# EAGLE design pinchy (EAGLE 7.7.0)

## Sheet 1 of 2
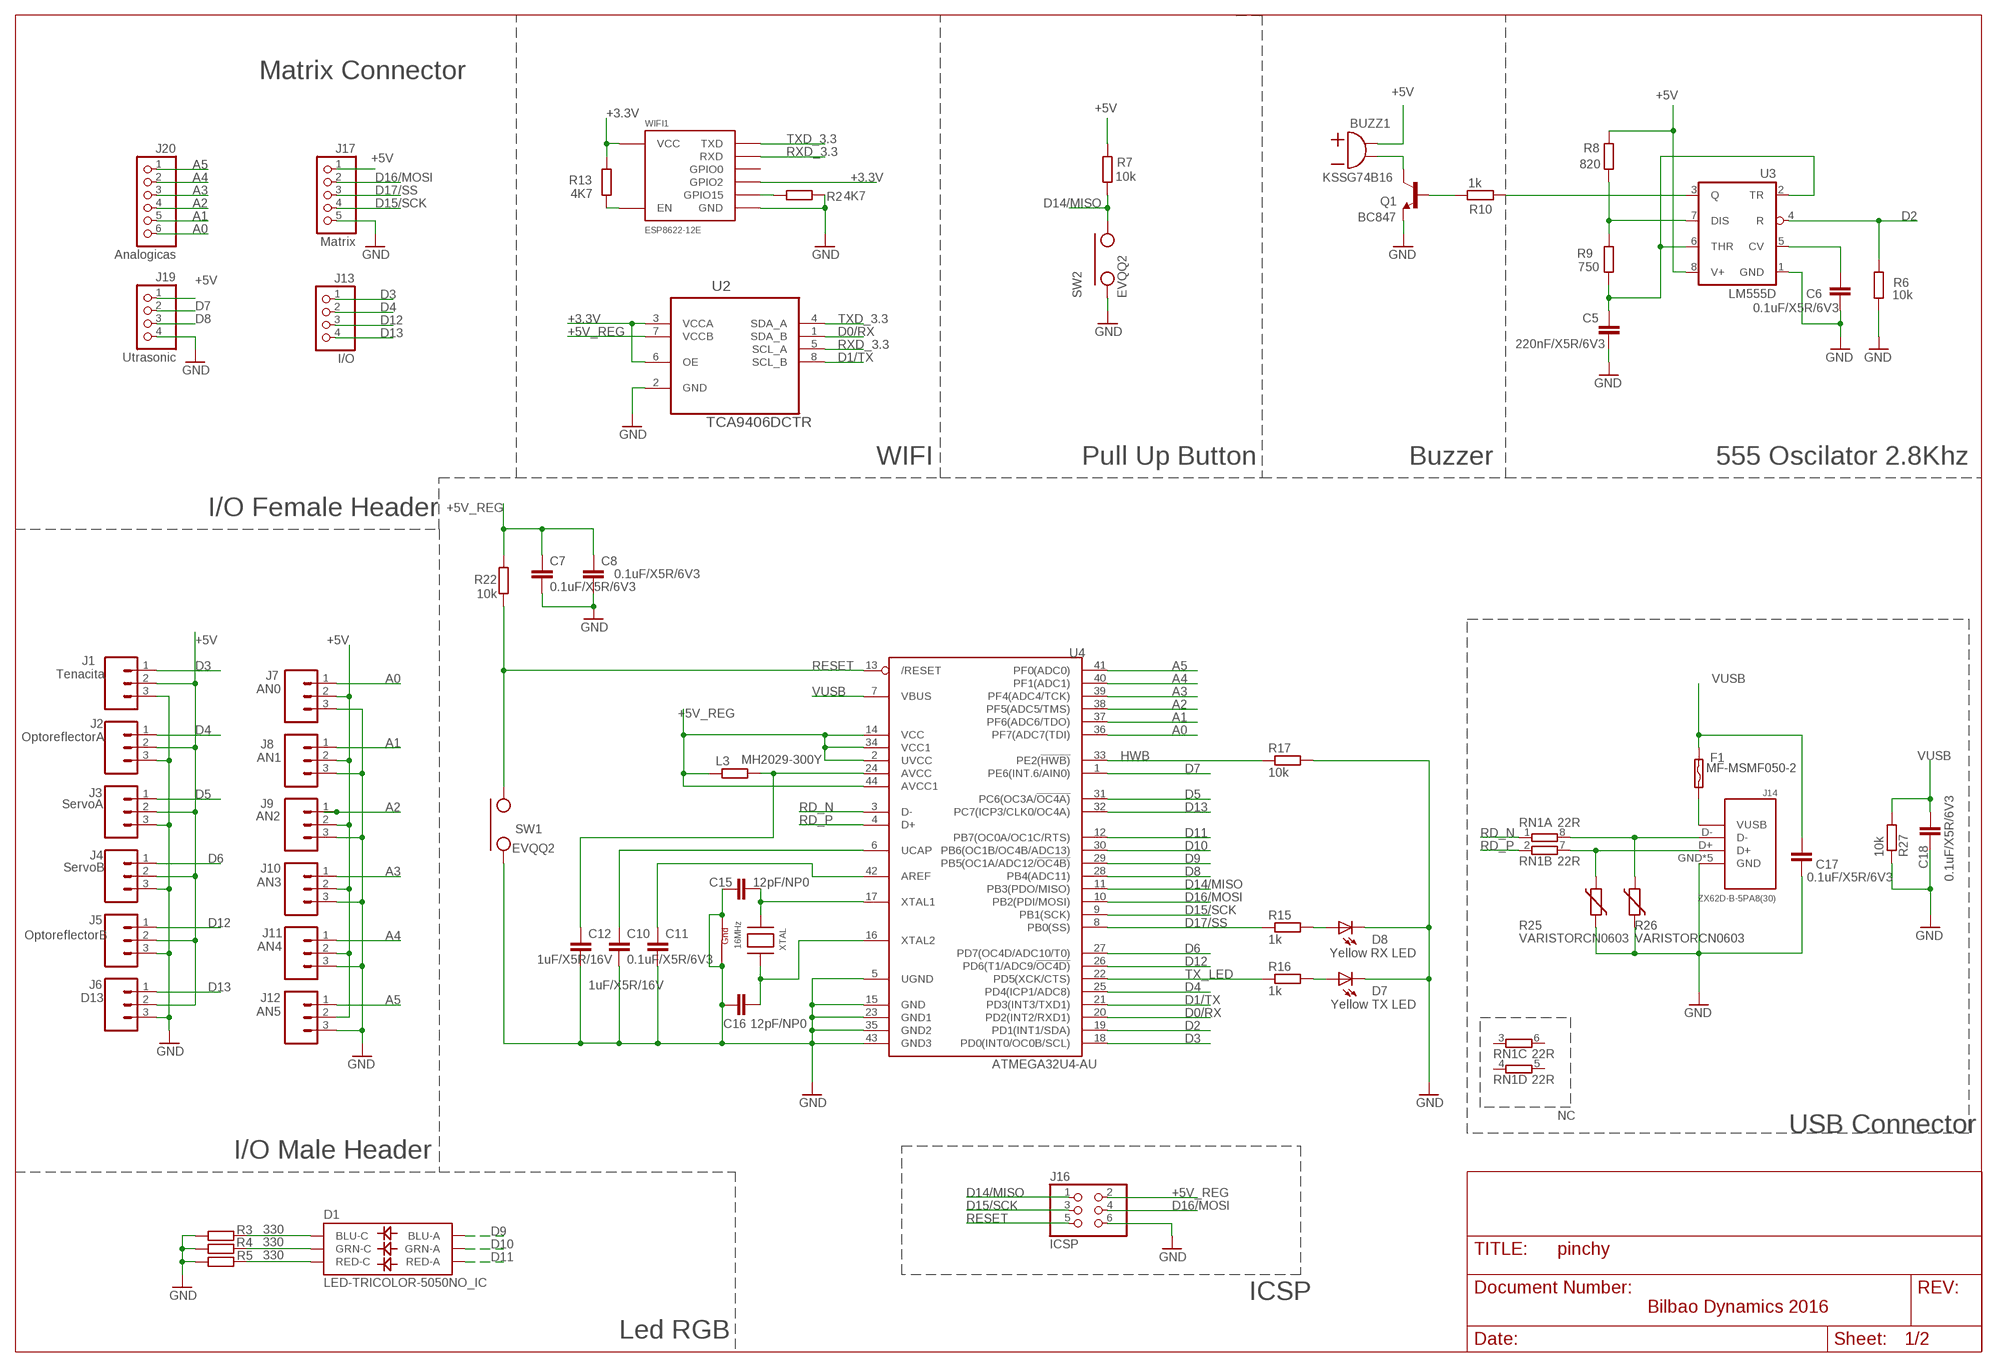
[diagram p0: schematic, sheet 1]

### Parts
BUZZ1  KSSG74B16  [KSSG74B16]
C5  220nF/X5R/6V3  C-EUC0805  [C0805]
C6  0.1uF/X5R/6V3  C-EUC0805  [C0805]
C7  0.1uF/X5R/6V3  C-EUC0805  [C0805]
C8  0.1uF/X5R/6V3  C-EUC0805  [C0805]
C10  1uF/X5R/16V  C-EUC1206  [C1206]
C11  0.1uF/X5R/6V3  C-EUC0805  [C0805]
C12  1uF/X5R/16V  C-EUC1206  [C1206]
C15  12pF/NP0  C-EUC0805  [C0805]
C16  12pF/NP0  C-EUC0805  [C0805]
C17  0.1uF/X5R/6V3  C-EUC1206  [C1206]
C18  0.1uF/X5R/6V3  C-EUC0805  [C0805]
D1  LED-TRICOLOR-5050NO_IC  [LED-TRICOLOR-5050]
D7  Yellow TX LED  LEDCHIPLED_0805  [CHIPLED_0805]
D8  Yellow RX LED  LEDCHIPLED_0805  [CHIPLED_0805]
F1  MF-MSMF050-2  SMD260F  [SMD050F]
J1  Tenacita  M03PTH  [1X03]
J2  OptoreflectorA  M03PTH  [1X03]
J3  ServoA  M03PTH  [1X03]
J4  ServoB  M03PTH  [1X03]
J5  OptoreflectorB  M03PTH  [1X03]
J6  D13  M03PTH  [1X03]
J7  AN0  M03PTH  [1X03]
J8  AN1  M03PTH  [1X03]
J9  AN2  M03PTH  [1X03]
J10  AN3  M03PTH  [1X03]
J11  AN4  M03PTH  [1X03]
J12  AN5  M03PTH  [1X03]
J13  I/O  PINHD-1X4  [1X04]
J14  ZX62D-B-5PA8(30)  [ZX62D-B-5PA8(30)]
J16  ICSP  PINHD-2X3  [2X03]
J17  Matrix  PINHD-1X5  [1X05]
J19  Utrasonic  PINHD-1X4  [1X04]
J20  Analogicas  PINHD-1X6  [1X06]
L3  MH2029-300Y  R-EU_R0805  [R0805]
Q1  BC847  [SOT23]
R2  4K7  R-EU_R0805  [R0805]
R3  330  R-EU_R0805  [R0805]
R4  330  R-EU_R0805  [R0805]
R5  330  R-EU_R0805  [R0805]
R6  10k  R-EU_R0805  [R0805]
R7  10k  R-EU_R0805  [R0805]
R8  820  R-EU_R0805  [R0805]
R9  750  R-EU_R0805  [R0805]
R10  1k  R-EU_R0805  [R0805]
R13  4K7  R-EU_R0805  [R0805]
R15  1k  R-EU_R0805  [R0805]
R16  1k  R-EU_R0805  [R0805]
R17  10k  R-EU_R0805  [R0805]
R22  10k  R-EU_R0805  [R0805]
R25  VARISTORCN0603  [CT/CN0603]
R26  VARISTORCN0603  [CT/CN0603]
R27  10k  R-EU_R0805  [R0805]
RN1  22R  4R-NCAY16  [CAY16]
SW1  EVQQ2  JAEGGER_MKII_EVQQ2  [JAEGGER_MKII_EVQQ2]
SW2  EVQQ2  JAEGGER_MKII_EVQQ2  [JAEGGER_MKII_EVQQ2]
U2  TCA9406DCTR  [SOP65P400X130-8N]
U3  LM555D  [SO08]
U4  ATMEGA32U4-AU  [TQFP44]
WIFI1  ESP8622-12E  [ESP8622-12E]
XTAL  16MHz  XTAL-4-3225  [NX3225]

### Nets
+3.3V: R13.2 U2.3(VCCA) U2.6(OE) WIFI1.GPIO2 WIFI1.VCC ; also sheet 2
+5V: BUZZ1.P$2 BUZZ1.P$3 J1.2 J2.2 J3.2 J4.2 J5.2 J6.2 J7.2 J8.2 J9.2 J10.2 J11.2 J12.2 J17.1 J19.1 R7.2 R8.2 U3.8(V+) ; also sheet 2
+5V_REG: C7.1 C8.1 J16.2 L3.1 R22.2 U2.7(VCCB) U4.2(UVCC) U4.14(VCC) U4.34(VCC1) U4.44(AVCC1) ; also sheet 2
A0: J7.1 J20.6 U4.36(PF7(ADC7(TDI))
A1: J8.1 J20.5 U4.37(PF6(ADC6/TDO))
A2: J9.1 J20.4 U4.38(PF5(ADC5/TMS))
A3: J10.1 J20.3 U4.39(PF4(ADC4/TCK))
A4: J11.1 J20.2 U4.40(PF1(ADC1))
A5: J12.1 J20.1 U4.41(PF0(ADC0))
D0/RX: U2.1(SDA_B) U4.20(PD2(INT2/RXD1))
D1/TX: U2.8(SCL_B) U4.21(PD3(INT3/TXD1))
D2: R6.1 U3.4(R) U4.19(PD1(INT1/SDA))
D3: J1.1 J13.1 U4.18(PD0(INT0/OC0B/SCL))
D4: J2.1 J13.2 U4.25(PD4(ICP1/ADC8))
D5: J3.1 U4.31(PC6(OC3A/!OC4A))
D6: J4.1 U4.27(PD7(OC4D/ADC10/T0))
D7: J19.2 U4.1(PE6(INT.6/AIN0))
D8: J19.3 U4.28(PB4(ADC11))
D9: D1.3(BLU-A) U4.29(PB5(OC1A/ADC12/!OC4B))
D10: D1.1(GRN-A) U4.30(PB6(OC1B/OC4B/ADC13))
D11: D1.2(RED-A) U4.12(PB7(OC0A/OC1C/RTS))
D12: J5.1 J13.3 U4.26(PD6(T1/ADC9/!OC4D))
D13: J6.1 J13.4 U4.32(PC7(ICP3/CLK0/OC4A))
D14/MISO: J16.1 R7.1 SW2.P$1 SW2.P$4 U4.11(PB3(PDO/MISO))
D15/SCK: J16.3 J17.4 U4.9(PB1(SCK))
D16/MOSI: J16.4 J17.2 U4.10(PB2(PDI/MOSI))
D17/SS: J17.3 R15.1 U4.8(PB0(SS))
GND: C5.2 C6.2 C7.2 C8.2 C10.2 C11.2 C12.2 C15.2 C16.2 C17.2 C18.2 D7.C D8.C J1.3 J2.3 J3.3 J4.3 J5.3 J6.3 J7.3 J8.3 J9.3 J10.3 J11.3 J12.3 J14.GND J14.P$1(GND) J14.P$2(GND) J14.P$6(GND) J14.P$7(GND) J16.6 J17.5 J19.4 Q1.2(E) R2.2 R3.1 R4.1 R5.1 R6.2 R17.2 R25.1 R26.1 R27.1 SW1.P$2 SW1.P$3 SW2.P$2 SW2.P$3 U2.2(GND) U3.1(GND) U4.5(UGND) U4.15(GND) U4.23(GND1) U4.35(GND2) U4.43(GND3) WIFI1.GND XTAL.2(G2) XTAL.4(G1) ; also sheet 2
HWB: R17.1 U4.33(PE2(!HWB))
N$1: R8.1 R9.2 U3.7(DIS)
N$2: R10.2 U3.3(Q)
N$3: D1.4(BLU-C) R3.2
N$4: D1.6(GRN-C) R4.2
N$6: D1.5(RED-C) R5.2
N$8: R13.1 WIFI1.EN
N$10: BUZZ1.P$1 BUZZ1.P$4 Q1.3(C)
N$11: C5.1 R9.1 U3.2(TR) U3.6(THR)
N$13: C6.1 U3.5(CV)
N$15: Q1.1(B) R10.1
N$16: R2.1 WIFI1.GPIO15
N$18: J14.D+ R25.2 RN1.7
N$19: J14.D- R26.2 RN1.8
N$22: F1.1 J14.VUSB
N$30: C15.1 U4.17(XTAL1) XTAL.1(X1)
N$31: C16.1 U4.16(XTAL2) XTAL.3(X2)
N$34: C10.1 U4.6(UCAP)
N$35: C12.1 L3.2 U4.24(AVCC)
N$38: D8.A R15.2
N$47: D7.A R16.2
RD_N: RN1.1 U4.3(D-)
RD_P: RN1.2 U4.4(D+)
RESET: J16.5 R22.1 SW1.P$1 SW1.P$4 U4.13(/RESET)
RXD_3.3: U2.5(SCL_A) WIFI1.RXD
TX_LED: R16.1 U4.22(PD5(XCK/CTS))
TXD_3.3: U2.4(SDA_A) WIFI1.TXD
U4: C11.1 U4.42(AREF)
VUSB: C17.1 C18.1 F1.2 R27.2 U4.7(VBUS) ; also sheet 2
Unconnected: RN1.3 RN1.4 RN1.5 RN1.6 WIFI1.GPIO0

### Notes on the sheet
- Matrix Connector
- WIFI | Pull Up Button | Buzzer | 555 Oscilator 2.8Khz
- I/O Female Header
- NC
- USB Connector
- I/O Male Header
- ICSP
- Bilbao Dynamics 2016
- Led RGB

## Sheet 2 of 2
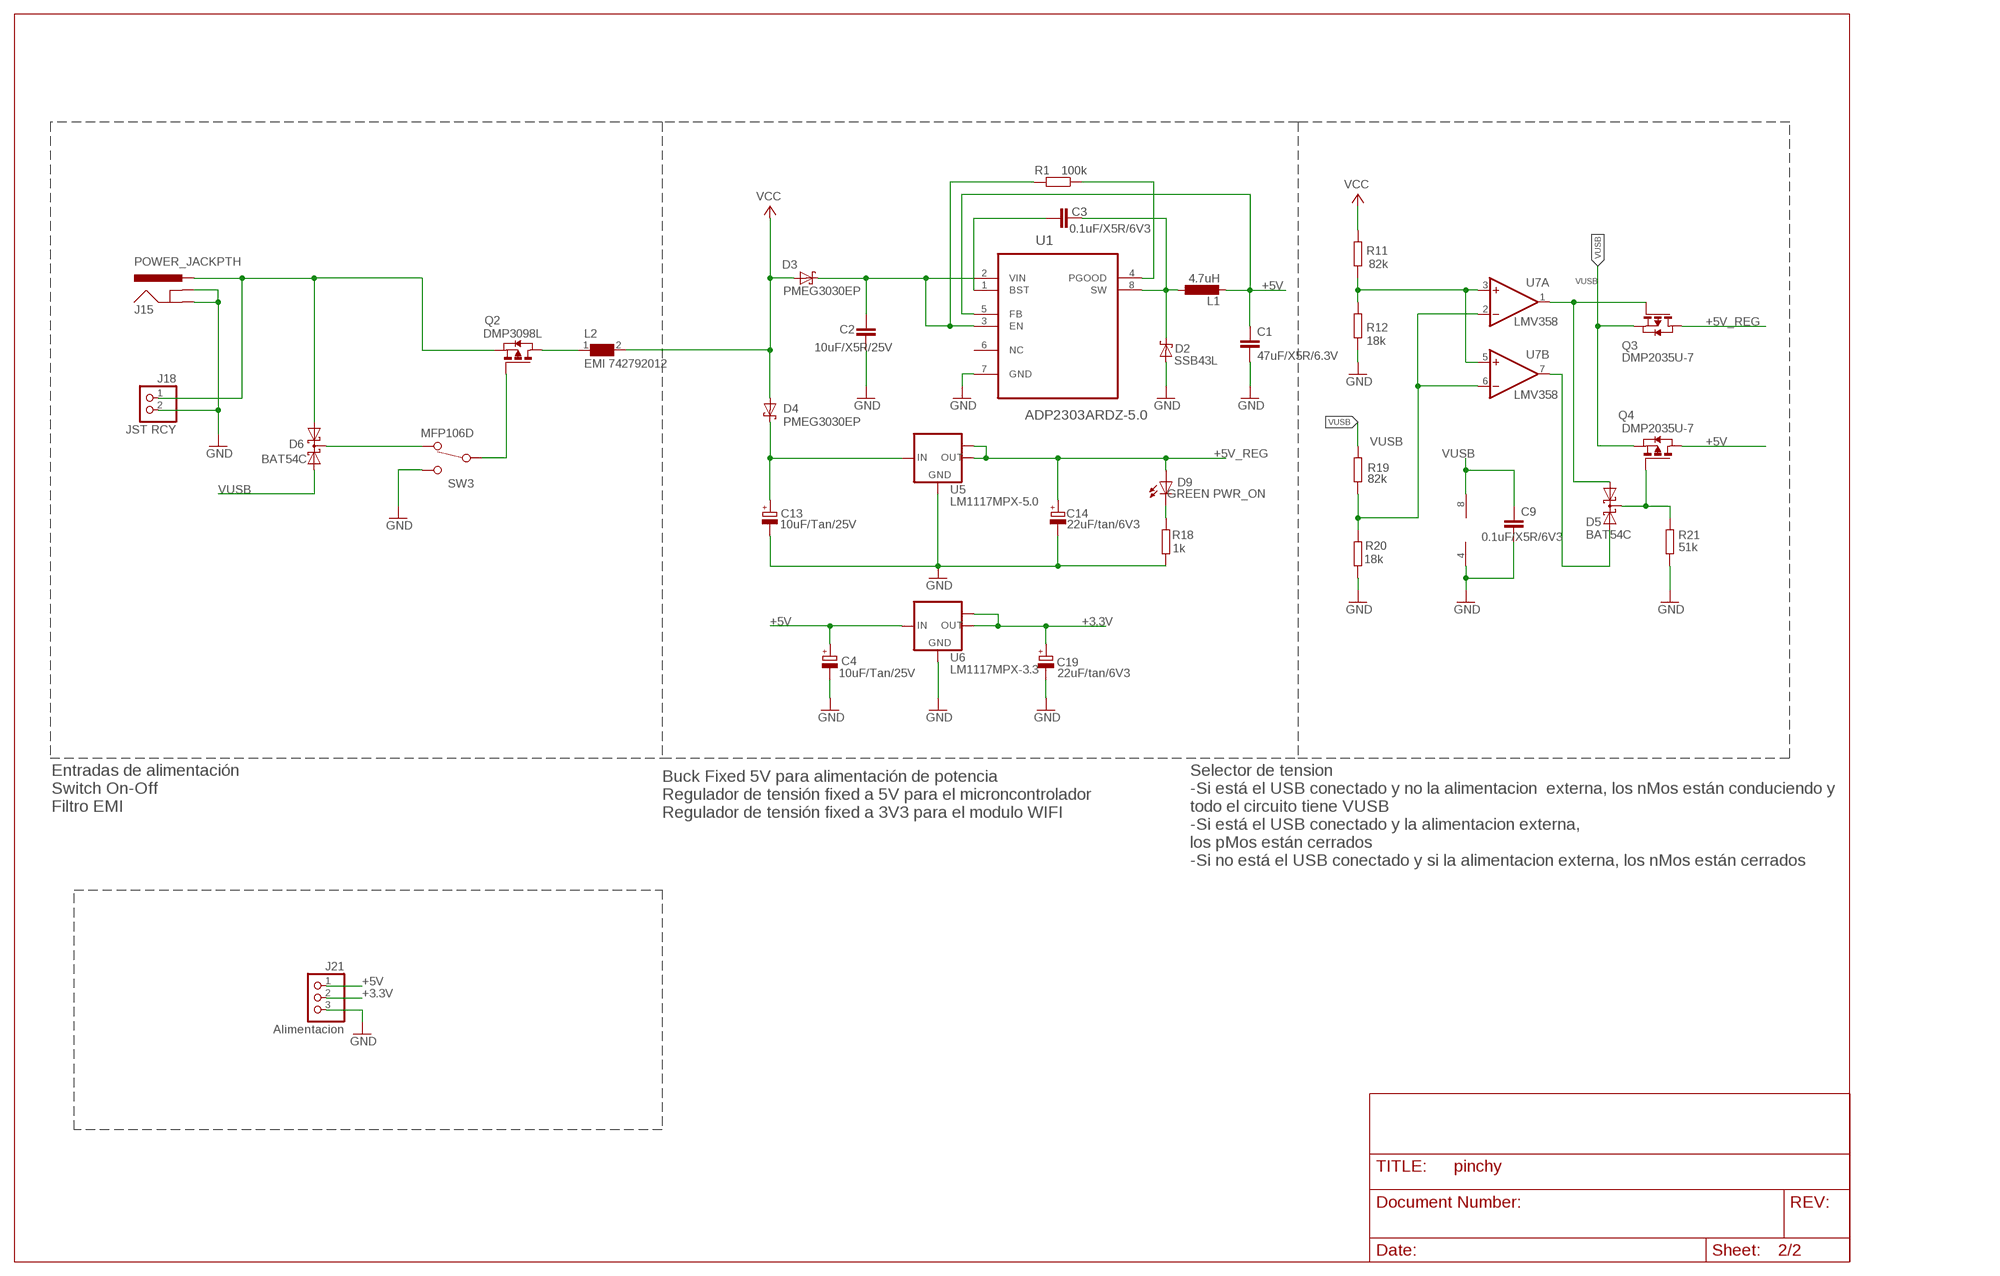
[diagram p1: schematic, sheet 2]

### Parts
C1  47uF/X5R/6.3V  C-EUC1210  [C1210]
C2  10uF/X5R/25V  C-EUC0805  [C0805]
C3  0.1uF/X5R/6V3  C-EUC0805  [C0805]
C4  10uF/Tan/25V  C1206-POL  [C1206-POL]
C9  0.1uF/X5R/6V3  C-EUC0805  [C0805]
C13  10uF/Tan/25V  C1206-POL  [C1206-POL]
C14  22uF/tan/6V3  C1206-POL  [C1206-POL]
C19  22uF/tan/6V3  C1206-POL  [C1206-POL]
D2  SSB43L  [SSB43L]
D3  PMEG3030EP  SCHOTTKY-DIODESMD  [SMB]
D4  PMEG3030EP  SCHOTTKY-DIODESMD  [SMB]
D5  BAT54C  [SOT23]
D6  BAT54C  [SOT23]
D9  GREEN PWR_ON  LEDCHIPLED_0805  [CHIPLED_0805]
J15  POWER_JACKPTH  [POWER_JACK_PTH]
J18  JST RCY  PINHD-1X2  [1X02]
J21  Alimentacion  PINHD-1X3  [1X03]
L1  4.7uH  TDK_VLF10040T_4R7N5R4  [TDK_VLF10040T_4R7N5R4]
L2  EMI 742792012  WE-CBF-742792012_0805  [0805]
Q2  DMP3098L  PMOSSOT23  [SOT-23]
Q3  DMP2035U-7  PMOSSOT23  [SOT-23]
Q4  DMP2035U-7  PMOSSOT23  [SOT-23]
R1  100k  R-EU_R0805  [R0805]
R11  82k  R-EU_R0805  [R0805]
R12  18k  R-EU_R0805  [R0805]
R18  1k  R-EU_R0805  [R0805]
R19  82k  R-EU_R0805  [R0805]
R20  18k  R-EU_R0805  [R0805]
R21  51k  R-EU_R0805  [R0805]
SW3  MFP106D  [MFP106D]
U1  ADP2303ARDZ-5.0  [SOIC127P600X175-9N]
U5  LM1117MPX-5.0  [SOT223]
U6  LM1117MPX-3.3  [SOT223]
U7  LMV358  LM358D  [SO08]

### Nets
+3.3V: C19.2(+) J21.2 U6.2(OUT) U6.TAB(OUT1) ; also sheet 1
+5V: C1.1 C4.2(+) J21.1 L1.2 Q4.1(D) U1.5(FB) U6.3(IN) ; also sheet 1
+5V_REG: C14.2(+) D9.A Q3.1(D) U5.2(OUT) U5.TAB(OUT1) ; also sheet 1
GND: C1.2 C2.2 C4.1(-) C9.2 C13.1(-) C14.1(-) C19.1(-) D2.2(A) J15.GND J15.GNDBREAK J18.2 J21.3 R12.1 R18.1 R20.1 R21.1 SW3.2 U1.7(GND) U5.1(GND) U6.1(GND) U7.4(P:V-) ; also sheet 1
N$5: C2.1 D3.C R1.2 U1.2(VIN) U1.3(EN)
N$9: R1.1 U1.4(PGOOD)
N$12: C3.2 D2.1(C) L1.1 U1.8(SW)
N$20: D6.1(A1) J15.PWR J18.1 Q2.2(S)
N$21: D5.3(CC) Q4.3(G) R21.2
N$23: L2.1 Q2.1(D)
N$25: R11.1 R12.2 U7.3(A:+IN) U7.5(B:+IN)
N$27: C3.1 U1.1(BST)
N$29: D5.1(A1) Q3.3(G) U7.1(A:OUT)
N$40: Q2.3(G) SW3.COM
N$42: D6.3(CC) SW3.1
N$44: C13.2(+) D4.C U5.3(IN)
N$46: D9.C R18.2
N$48: D5.2(A2) U7.7(B:OUT)
N$49: R19.1 R20.2 U7.2(A:-IN) U7.6(B:-IN)
VCC: D3.A D4.A L2.2 R11.2
VUSB: C9.1 D6.2(A2) Q3.2(S) Q4.2(S) R19.2 U7.8(P:V+) ; also sheet 1
Unconnected: U1.6(NC)

### Notes on the sheet
- Entradas de alimentación
  Switch On-Off
  Filtro EMI
- Buck Fixed 5V para alimentación de potencia
  Regulador de tensión fixed a 5V para el microncontrolador
  Regulador de tensión fixed a 3V3 para el modulo WIFI
- Selector de tension
  -Si está el USB conectado y no la alimentacion  externa, los nMos están conduciendo y
  todo el circuito tiene VUSB
  -Si está el USB conectado y la alimentacion externa, 
  los pMos están cerrados
  -Si no está el USB conectado y si la alimentacion externa, los nMos están cerrados

## Library data of the parts
BUZZ1 = mk2:KSSG74B16
C1-C3 C5-C12 C15-C18 = rcl:C-EU: CAPACITOR, European symbol
C4 C13 C14 C19 = lib_Pinchy:C1206-POL
D1 = SparkFun-LED:LED-TRICOLOR-5050
D2 = lib_Pinchy:SSB43L
D3 D4 = diode:SCHOTTKY-DIODE: Schottky Diode
D5 D6 = diode:BAT54C: Schottky Diodes Source: Fairchild .. BAT54.pdf
D7-D9 = adafruit:LED: LED OSRAM: - CHIPLED LG R971, LG N971, LY N971, LG Q971, LY Q971, LO R971, LY R971 LH N974, LH R974 LS Q976, LO Q976, LY Q976 LO Q996 - Hyper CHIPLED LW Q18S LB Q993, LB Q99A, LB R99A - SideLED LS A670, LO A670, LY A670, LG A670, LP A670 LB A673, LV A673, LT A673, LW A673 LH A674 LY A675 LS A676, LA A676, LO A676, LY A676, LW A676 LS A679, LY A679, LG A679 - Hyper Micro SIDELED® LS Y876, LA Y876, LO Y876, LY Y876 LT Y87S - SmartLED LW L88C, LW L88S LB L89C, LB L89S, LG L890 LS L89K, LO L89K, LY L89K LS L896, LA L896, LO L896, LY L896 - TOPLED LS T670, LO T670, LY T670, LG T670, LP T670 LSG T670, LSP T670, LSY T670, LOP T670, LYG T670 LG T671, LOG T671, LSG T671 LB T673, LV T673, LT T673, LW T673 LH T674 LS T676, LA T676, LO T676, LY T676, LB T676, LH T676, LSB T676, LW T676 LB T67C, LV T67C, LT T67C, LS T67K, LO T67K, LY T67K, LW E67C LS E67B, LA E67B, LO E67B, LY E67B, LB E67C, LV E67C, LT E67C LW T67C LS T679, LY T679, LG T679 LS T770, LO T770, LY T770, LG T770, LP T770 LB T773, LV T773, LT T773, LW T773 LH T774 LS E675, LA E675, LY E675, LS T675 LS T776, LA T776, LO T776, LY T776, LB T776 LHGB T686 LT T68C, LB T68C - Hyper Mini TOPLED® LB M676 - Mini TOPLED Santana® LG M470 LS M47K, LO M47K, LY M47K Source: http://www.osram.convergy.de/
F1 = switch-raychem:SMD*F: PolySwitch (TM) Resettable Device Source: Data sheet <http://www.farnell.com/datasheets/13482.pdf>
J1-J12 = SparkFun-Connectors:M03: Header 3 Standard 3-pin 0.1" header. Use with straight break away headers (SKU : PRT-00116), right angle break away headers (PRT-00553), swiss pins (PRT-00743), machine pins (PRT-00117), and female headers (PRT-00115). Molex polarized connector foot print use with SKU : PRT-08232 with associated crimp pins and housings.
J13 J19 = pinhead:PINHD-1X4: PIN HEADER
J14 = lib_Pinchy:ZX62D-B-5PA8(30)
J15 = SparkFun-Connectors:POWER_JACK: Power Jack This is the standard 5.5mm barrel jack for power. The PTH is the most common, proven, reliable, footprint. The Slot footprint only works if the mill layer is transmitted to the PCB fab house so be warned. Mating wall wart : TOL-00298 (and others); PROD_ID: CONN-08197
J16 = pinhead:PINHD-2X3: PIN HEADER
J17 = pinhead:PINHD-1X5: PIN HEADER
J18 = pinhead:PINHD-1X2: PIN HEADER
J20 = pinhead:PINHD-1X6: PIN HEADER
J21 = pinhead:PINHD-1X3: PIN HEADER
L1 = lib_Pinchy:TDK_VLF10040T_4R7N5R4
L2 = WE-CBF:WE-CBF: SMD EMI Suppression Ferrite Beads WE-CBF - Excellent anti-EMI properties - Low DC-restistance - Impedances till 3000 ohms - Rated current up to 6 A -- Reliable Ni-Sn electrodes -- Perfect as data lined filter and for uncoupling of distribution voltage; MPN: 742792012; OC_FARNELL: 1800367; OC_NEWARK: 78R5636; PACKAGE: IND-0805; SUPPLIER: Wuerth Elektronik
L3 R1-R13 R15-R22 R27 = rcl:R-EU_: RESISTOR, European symbol
Q1 = transistor:BC847: NPN TRANSISTOR
Q2-Q4 = zetex:PMOSSOT23: MOS FET; OC_FARNELL: unknown; OC_NEWARK: unknown
R25 R26 = varistor:VARISTOR: VARISTOR
RN1 = resistor-dil:4R-N: Array Chip Resistor Source: RS Component / Phycomp; OC_FARNELL: unknown; OC_NEWARK: unknown
SW1 SW2 = mk2:JAEGGER_MKII_EVQQ2
SW3 = mk2:MFP106D
U1 = lib_Pinchy:ADP2303ARDZ-5.0: Step-Down Regulators; MPN: ADP2303ARDZ-5.0; OC_FARNELL: 1843645; OC_NEWARK: 12T1264; PACKAGE: SOIC-8; SUPPLIER: Analog Devices
U2 = lib_Pinchy:TCA9406DCTR: 2-BIT BIDIRECTIONAL 1MHz, I2C BUS AND SMBUS VOLTAGE-LEVEL TRANSLATOR WITH 8kV HBM ESD,SM8-8; MPN: TCA9406DCTR; OC_FARNELL: 1972384; OC_NEWARK: 86W6768; PACKAGE: SM8-8; SUPPLIER: TEXAS INSTRUMENTS
U3 = linear:*555: TIMER
U4 = adafruit:ATMEGA32U4: http://www.ladyada.net/library/eagle
U5 = lm1117:LM1117MPX-*
U6 = pinchy:LM1117MPX-*
U7 = linear:LM358: OP AMP also LM158; LM258; LM2904 Source: http://cache.national.com/ds/LM/LM158.pdf
WIFI1 = lib_Pinchy:ESP8622-12E
XTAL = adafruit:XTAL-4: Classic 4-pin 3.2 x 2.5mm crystal

## Net classes
0 default: clearance 0.205 mm

## Board
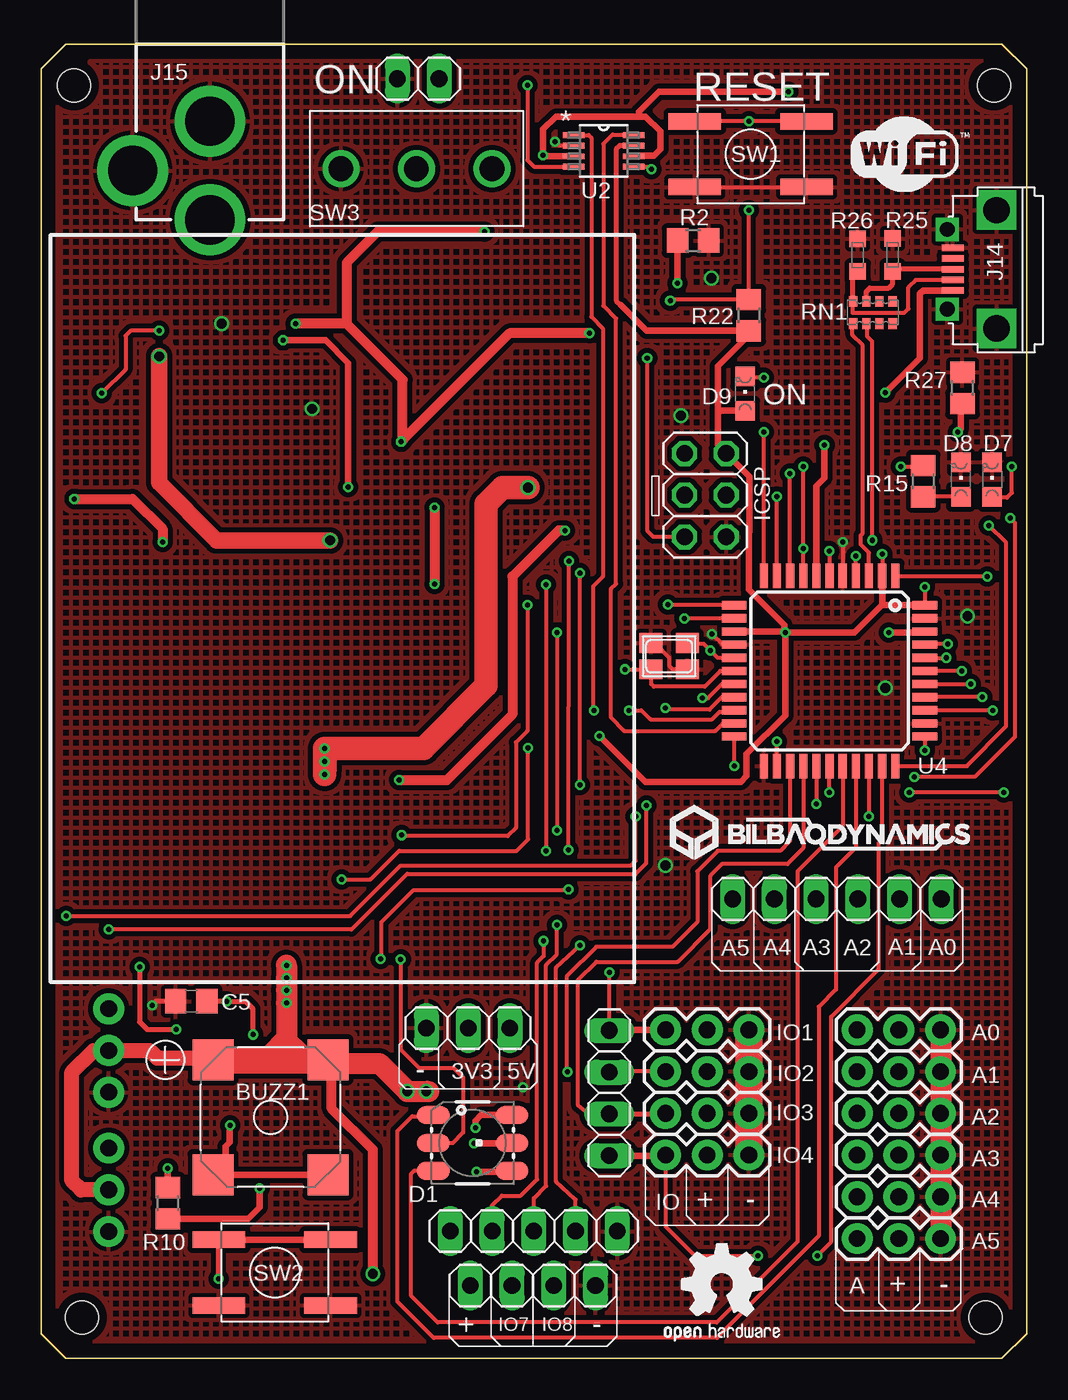
[diagram p2: board, top side]
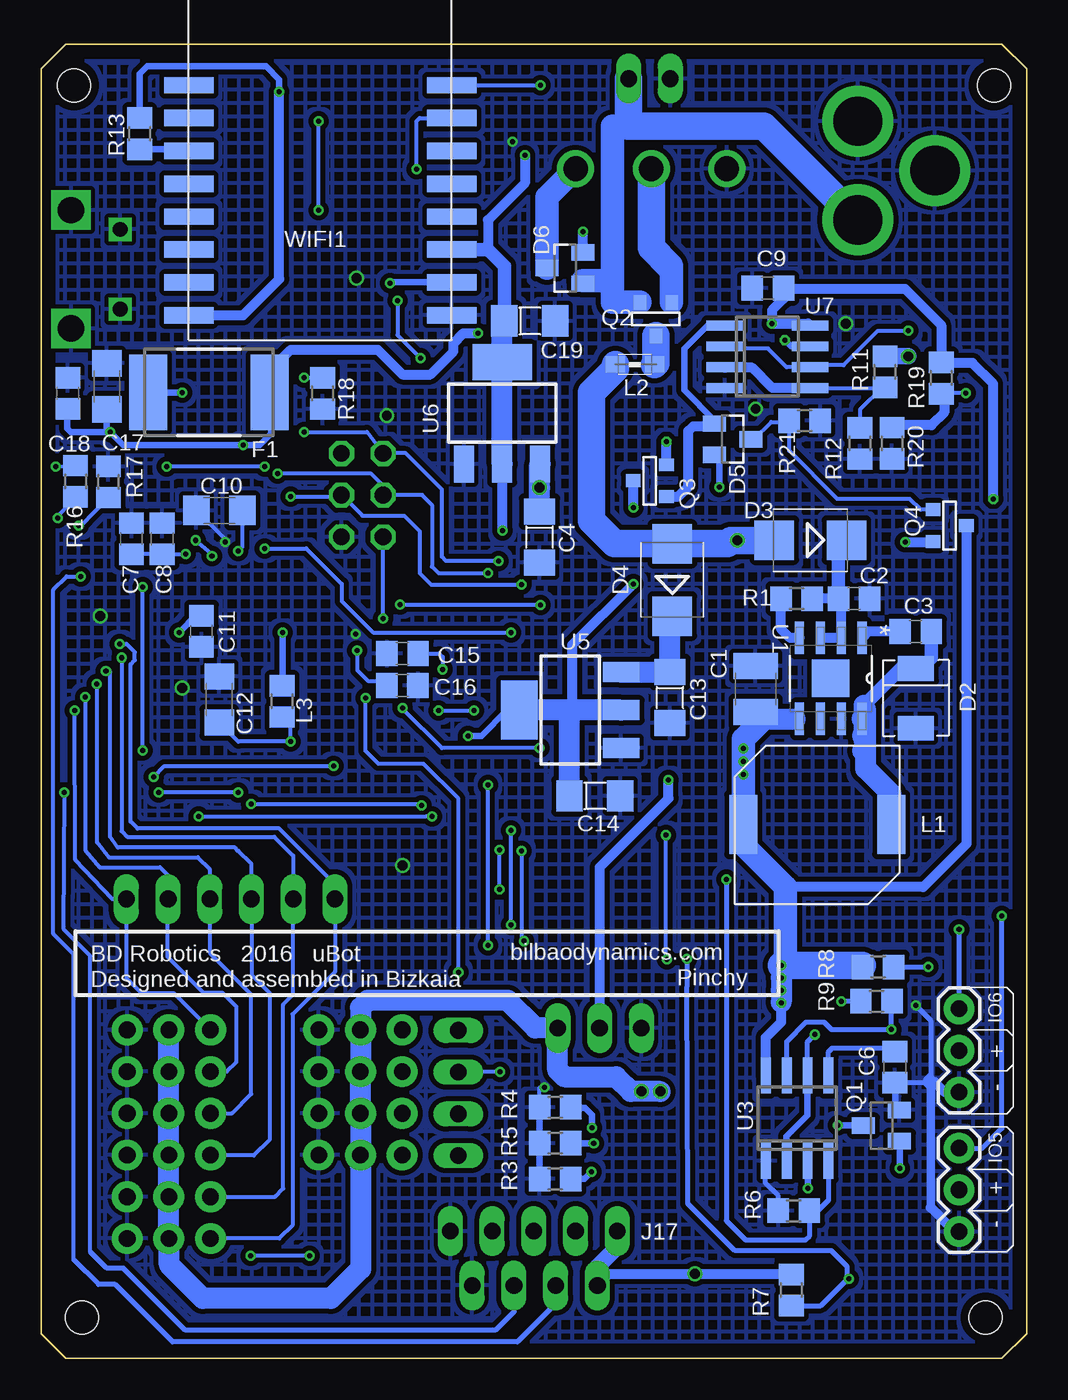
[diagram p3: board, bottom side, seen from below]

Size 60 x 80 mm. Coordinates in mm from the lower left corner, seen from the top.
Outline: 58.5,0 1.5,0 0,1.5 0,78.5 1.5,80 58.5,80 60,78.5 60,1.5 58.5,0
Copper layers (1*16): Top 0.035mm / dielectric 1.5mm / Bottom 0.035mm
Design rules "EagleRules": minimum track width 7mil, minimum drill 12mil, track to track 7mil, track to pad 7mil, pad to pad 7mil, via to via 7mil, smd to smd 0mil, copper to edge 20mil, drill to drill 10mil, minimum pad ring 10mil, minimum via ring 6mil, stop-mask expansion 2mil, vias tented up to drill 25mil, thermal gap 10mil
Holes 2 mm at 2.5,2.5 2,77.5 58,77.5 57.5,2.5

### Footprints (pad centres in the part's own frame; a part is rotated, then mirrored left to right if it is on the bottom)
KSSG74B16 = smd 2.5 x 2.5: P$1 3.5,3.5; P$2 3.5,-3.5; P$3 -3.5,-3.5; P$4 -3.5,3.5
C1210 = smd 1.6 x 2.7: 1 -1.4,0; 2 1.4,0
C0805 = smd 1.3 x 1.5: 1 -0.95,0; 2 0.95,0
C1206-POL = smd 1.6 x 1.9: 1 0,0; 2 3.1,0
C1206 = smd 1.6 x 1.8: 1 -1.4,0; 2 1.4,0
LED-TRICOLOR-5050 = smd 2 x 1.1: 1 -2.4,1.7; 2 -2.4,0; 3 -2.4,-1.7; 4 2.4,-1.7; 5 2.4,0; 6 2.4,1.7
SSB43L = smd 1.5 x 2.2: 1 0,0; 2 3.65,0
SMB = smd 2.4 x 2.4: A 2.2,0; C -2.2,0
SOT23 = smd 1 x 1.4: 1 -0.95,-1.1; 2 0.95,-1.1; 3 0,1.1
CHIPLED_0805 = smd 1.2 x 1.2: A 0,-1.05; C 0,1.05
SMD050F = smd 2.3 x 4.6: 1 -3.7,0; 2 3.7,0
1X03 = drill 1.016 pad 1.88: 1 0,0; 2 2.54,0; 3 5.08,0
1X04 = drill 1.016 long: 1 -3.81,0; 2 -1.27,0; 3 1.27,0; 4 3.81,0
ZX62D-B-5PA8(30) = smd 0.4 x 1.35: D+ 1.3,0; D- 0.65,0; GND 2.6,0; ID 1.95,0; VUSB 0,0 | drill 1.6 pad 1.778 square: P$1 -2.3,-2.675; P$2 4.9,-2.675 | drill 0.9 pad 1.016 square: P$6 -1.125,0.325; P$7 3.725,0.325
POWER_JACK_PTH = drill 2.997 pad 4.318: GND 0,7.7; GNDBREAK 4.7,10.7; PWR 0,13.7
2X03 = drill 1.016 octagon: 1 -2.54,-1.27; 2 -2.54,1.27; 3 0,-1.27; 4 0,1.27; 5 2.54,-1.27; 6 2.54,1.27
1X05 = drill 1.016 long: 1 -5.08,0; 2 -2.54,0; 3 0,0; 4 2.54,0; 5 5.08,0
1X02 = drill 1.016 long: 1 -1.27,0; 2 1.27,0
1X06 = drill 1.016 long: 1 -6.35,0; 2 -3.81,0; 3 -1.27,0; 4 1.27,0; 5 3.81,0; 6 6.35,0
1X03' = drill 1.016 long: 1 -2.54,0; 2 0,0; 3 2.54,0
TDK_VLF10040T_4R7N5R4 = smd 1.7 x 3.6: 1 0,0; 2 9,0
0805 = smd 1.2 x 1: 1 -1.2,0; 2 1.2,0
R0805 = smd 1.3 x 1.5: 1 -0.95,0; 2 0.95,0
SOT-23 = smd 0.787 x 0.889: 1 0.025,-1.016; 2 -0.94,1.016; 3 0.991,1.016
CT/CN0603 = smd 1 x 1: 1 -1,0; 2 1,0
CAY16 = smd 0.5 x 0.65: 1 -1.2,-0.675; 2 -0.4,-0.675; 3 0.4,-0.675; 4 1.2,-0.675; 5 1.2,0.675; 6 0.4,0.675; 7 -0.4,0.675; 8 -1.2,0.675
JAEGGER_MKII_EVQQ2 = smd 3.2 x 1: P$1 -3.4,2; P$2 -3.4,-2; P$3 3.4,-2; P$4 3.4,2
MFP106D = drill 1.5: 1 -4.6,0; 2 4.6,0; COM 0,0
SOIC127P600X175-9N = smd 1.981 x 0.559: 1 -2.464,1.905; 2 -2.464,0.635; 3 -2.464,-0.635; 4 -2.464,-1.905; 5 2.464,-1.905; 6 2.464,-0.635; 7 2.464,0.635; 8 2.464,1.905 | smd 2.286 x 2.286: 9 0,0
SOP65P400X130-8N = smd 1.321 x 0.356: 1 -1.829,0.965; 2 -1.829,0.33; 3 -1.829,-0.33; 4 -1.829,-0.965; 5 1.829,-0.965; 6 1.829,-0.33; 7 1.829,0.33; 8 1.829,0.965
SO08 = smd 0.6 x 2.2: 1 -1.905,-2.6; 2 -0.635,-2.6; 3 0.635,-2.6; 4 1.905,-2.6; 5 1.905,2.6; 6 0.635,2.6; 7 -0.635,2.6; 8 -1.905,2.6
TQFP44 = smd 1.5 x 0.5: 1 -5.8,4; 2 -5.8,3.2; 3 -5.8,2.4; 4 -5.8,1.6; 5 -5.8,0.8; 6 -5.8,0; 7 -5.8,-0.8; 8 -5.8,-1.6; 9 -5.8,-2.4; 10 -5.8,-3.2; 11 -5.8,-4; 23 5.8,-4; 24 5.8,-3.2; 25 5.8,-2.4; 26 5.8,-1.6; 27 5.8,-0.8; 28 5.8,0; 29 5.8,0.8; 30 5.8,1.6; 31 5.8,2.4; 32 5.8,3.2; 33 5.8,4 | smd 0.5 x 1.5: 12 -4,-5.8; 13 -3.2,-5.8; 14 -2.4,-5.8; 15 -1.6,-5.8; 16 -0.8,-5.8; 17 0,-5.8; 18 0.8,-5.8; 19 1.6,-5.8; 20 2.4,-5.8; 21 3.2,-5.8; 22 4,-5.8; 34 4,5.8; 35 3.2,5.8; 36 2.4,5.8; 37 1.6,5.8; 38 0.8,5.8; 39 0,5.8; 40 -0.8,5.8; 41 -1.6,5.8; 42 -2.4,5.8; 43 -3.2,5.8; 44 -4,5.8
SOT223 = smd 1.219 x 2.235: 1 -2.311,-3.099; 2 0,-3.099; 3 2.311,-3.099 | smd 3.6 x 2.2: TAB 0,3.099
ESP8622-12E = smd 3 x 1: 1 0,-0.5; 2 0,-2.5; 4 0,-6.5; 5 0,-8.5; 6 0,-10.5; 7 0,-12.5; 13 16,-6.5; 14 16,-4.5; EN 0,-4.5; GND 16,-14.5; GPIO0 16,-8.5; GPIO2 16,-10.5; GPIO15 16,-12.5; RXD 16,-2.5; TXD 16,-0.5; VCC 0,-14.5
NX3225 = smd 1.4 x 1.2: 1 -1.1,-0.8; 2 1.1,-0.8; 3 1.1,0.8; 4 -1.1,0.8

### Placement (x,y rotation side)
BUZZ1  13.97,14.68 180 top
C1  16.5,40.75 90 bottom
C2  10.5,46.25 0 bottom
C3  6.75,44.25 0 bottom
C4  29.65,48.45 90 bottom
C5  9.14,21.74 180 top
C6  8.03,17.73 270 bottom
C7  54.49,49.9 90 bottom
C8  52.62,49.9 90 bottom
C9  15.75,65.15 180 bottom
C10  49.15,51.61 180 bottom
C11  50.23,44.26 270 bottom
C12  49.15,40.11 90 bottom
C13  21.71,38.68 90 bottom
C14  24.73,34.24 180 bottom
C15  38,42.91 180 bottom
C16  38.01,40.96 0 bottom
C17  55.99,59.17 90 bottom
C18  58.37,58.74 90 bottom
C19  28.7,63.15 180 bottom
D1  26.27,13.12 0 top
D2  6.75,42 270 bottom
D3  13.17,49.81 180 bottom
D4  21.58,47.39 90 bottom
D5  17.9,55.96 270 bottom
D6  28.1,66.37 90 bottom
D7  57.9,53.5 0 top
D8  56,53.5 0 top
D9  42.86,58.74 0 top
F1  49.78,58.8 0 bottom
J1  38.02,20 0 top
J2  38.02,17.46 0 top
J3  4.11,12.8 270 bottom
J4  4.11,21.29 270 bottom
J5  38.02,14.92 0 top
J6  38.02,12.38 0 top
J7  49.68,20 0 top
J8  49.68,17.46 0 top
J9  49.68,14.92 0 top
J10  49.68,12.38 0 top
J11  49.68,9.84 0 top
J12  49.68,7.3 0 top
J13  34.59,16.15 270 top
J14  55.5,65 90 top
J15  10.28,83.01 180 top
J16  40.44,52.55 270 top
J17  30,7.75 0 top
J18  22.96,77.9 180 top
J19  29.94,4.44 0 top
J20  48.46,27.97 0 top
J21  Alimentacion  [1X03']  26,20.11 180 top
L1  8.25,32.5 180 bottom
L2  23.85,60.5 180 bottom
L3  45.32,40 270 bottom
Q1  8.84,14.17 90 bottom
Q2  22.6,63.27 0 bottom
Q3  22.94,53.45 270 bottom
Q4  4.69,50.67 90 bottom
R1  14,46.25 0 bottom
R2  39.7,68.05 0 top
R3  28.7,10.92 0 bottom
R4  28.7,15.29 0 bottom
R5  28.7,13.11 0 bottom
R6  14.17,8.99 180 bottom
R7  14.33,4.17 90 bottom
R8  9.04,23.82 180 bottom
R9  9.14,21.74 0 bottom
R10  7.72,9.45 270 top
R11  8.62,60.05 90 bottom
R12  10.15,55.7 90 bottom
R13  54,74.55 90 bottom
R15  53.7,53.4 270 top
R16  57.9,53.4 90 bottom
R17  55.9,53.35 90 bottom
R18  42.86,58.74 90 bottom
R19  5.19,59.67 90 bottom
R20  8.19,55.71 90 bottom
R21  13.51,57.08 180 bottom
R22  43.08,63.5 270 top
R25  51.84,67.17 270 top
R26  49.72,67.16 270 top
R27  56.09,59.07 270 top
RN1  50.63,63.67 0 top
SW1  43.2,73.3 0 top
SW2  14.22,5.23 0 top
SW3  22.85,72.42 180 top
U1  11.92,41.4 270 bottom
U2  34.25,73.5 0 top
U3  13.97,14.63 0 bottom
U4  48,41.85 270 top
U5  27.79,39.47 90 bottom
U6  31.93,57.54 0 bottom
U7  15.78,60.97 270 bottom
WIFI1  51,78 0 bottom
XTAL  38.24,42.75 0 top

### Tracks (layer width: path | path; a pad name or v marks a point on that pad's centre or on a via)
+3.3V  (via drill 0.3, 0.3 pad 0.61)
  Top 0.254: 36.11,73.2 U2.6
  Top 0.406: 36.4,75.6 31.33,75.6 30.55,74.82 v30.55,73.25 30.63,73.17 U2.3 | 36.4,75.6 36.4,75.9 37.6,77.1 v45.5,77.1 | 36.4,75.6 36.8,75.6 37.7,74.7 37.7,73.6 37.3,73.2 36.11,73.2
  Top 0.61: v31.9,50.4 31.5,50.4 28.7,47.6 28.7,39.2 24.7,35.2 v21.8,35.2
  Bottom 0.406: R13.2 54,78.2 53.55,78.65 46.3,78.65 45.5,77.85 v45.5,77.1
  Bottom 0.61: v30.55,73.25 30.55,71.55 32.8,69.3 32.8,67.7 33,67.5 | U6.2 31.93,50.43 v31.9,50.4 | J21.2 26,29.9 21.8,34.1 v21.8,35.2 | WIFI1.VCC 47.7,63.5 45.5,65.7 v45.5,77.1
  Bottom 0.813: C19.2 31.8,66.5 32.8,67.5 33,67.5 WIFI1.GPIO2
  Bottom 1.27: U6.2 U6.TAB 31.93,63.02 C19.2
+5V  (via drill 0.3, 0.3 pad 0.61, 0.6, 0.61)
  Top 0.61: v20.2,5.15 20.2,12.7 17.7,15.2 17.7,17.95 BUZZ1.P$3
  Top 0.914: J3.2 2.44,10.26 1.88,10.82 1.88,17.43 3.19,18.75 J4.2 6.6,18.75 7.06,18.29 10.36,18.29 BUZZ1.P$2
  Top 1.27: 14.89,19.4 14.89,19.41 13.97,18.49 | 14.89,19.4 14.89,18.23 14.94,18.18 | 14.89,19.4 15.7,18.59 | v14.94,23.93 v14.94,23.16 v14.94,22.4 v14.94,21.64 14.94,19.45 14.89,19.4 | 40.55,12.37 J6.2 | 52.2,7.28 J12.2 | 17.7,17.95 20.6,17.95 v22.3,16.25 v23.45,16.25 23.6,16.25
  Top 1.422: v29.65,53 28.1,53 27.1,52 27.1,40.97 23.27,37.14 v17.25,37.14 17.25,35.87 17.3,35.87 17.3,36.34 | 17.3,36.34 17.3,37.1 | 17.3,36.34 v17.25,36.34 v17.25,35.54
  Top 1.676: BUZZ1.P$2 14.94,18.18 BUZZ1.P$3
  Bottom 0.254: 14.7,24.16 v14.94,23.93 | C1.1 16.7,39.35
  Bottom 0.305: U1.5 14.07,38.93 14.1,38.9
  Bottom 0.406: 9.99,23.93 R8.2
  Bottom 0.61: U3.8 15.88,19.53 14.94,20.47 v14.94,21.64 | L1.2 17.25,31.25 | Q4.1 3.67,31.33 6.3,28.7 14.4,28.7 14.7,28.4 | R7.2 20.2,5.12 | 20.2,5.12 25.46,5.12 J19.1 | 20.2,5.12 v20.2,5.15
  Bottom 1.016: J19.1 26.13,5.57 24.9,6.8 24.9,7.73 J17.1
  Bottom 1.27: v14.94,23.93 v14.94,23.16 v14.94,22.4 14.94,21.69 | J7.2 J8.2 J9.2 J10.2 J11.2 J12.2 52.2,7.28 52.2,5.7 50.15,3.65 42.35,3.65 40.55,5.45 40.55,11.7 | 40.49,12.31 40.55,12.37 | 40.55,12.37 J6.2 | C4.2 v29.65,53 29.65,54.41 U6.3 | 40.55,12.37 40.55,11.7 | 14.1,38.9 16.05,38.9 C1.1 | 40.55,11.7 40.56,11.71 J5.2 J2.2 J1.2 40.55,21.35 40.1,21.8 31.6,21.8 29.91,20.11 J21.1 28.55,17.55 28.15,17.15 25,17.15 24.1,16.25 v22.3,16.25
  Bottom 1.422: 17.25,31.25 14.7,28.7 14.7,28.4 14.7,24.23 14.4,23.93 | L1.2 v17.25,37.14 17.25,37.7 16.05,38.9
  Bottom 1.676: v14.94,23.93 14.4,23.93 9.99,23.93
+5V_REG  (via drill 0.3)
  Top 0.254: U4.34 v53.8,37 | v53.8,46.95 U4.44 | v51.2,48.95 U4.2
  Top 0.305: U2.7 35.23,73.83 35,73.6 35,64.4 35.3,64.1
  Top 0.406: 35.3,64.1 36.85,62.55 R22.2 43.08,62.28 41.2,60.4 41.2,57.5 | v34,37.9 36.8,35.1 42.6,35.1 42.95,35.45 42.95,36.8 45.3,39.15 v45.3,44.2 | U4.14 45.25,44.25 | 45.25,44.25 v45.3,44.2 | v45.3,44.2 49.5,44.2 51.2,45.9 | 51.2,45.9 U4.2 | U4.44 51.25,45.85 51.2,45.9 | 45.25,44.25 45.25,44.65 43.1,46.8 43.12,53.68 J16.2 41.22,55.62 41.2,57.5 | D9.A 41.39,57.69 41.2,57.5
  Top 0.61: v23.95,51.8 v23.95,47.15
  Bottom 0.254: v53.8,37 v53.8,46.95 | C7.1 C8.1 v51.2,48.95 | 45.3,42.1 45.3,40.97
  Bottom 0.406: U5.TAB 31.63,39.47 33.2,37.9 v34,37.9 | v45.3,44.2 45.3,40.97 L3.1
  Bottom 0.61: Q3.1 v23.96,51.81 v23.95,51.8 | 27.83,38.45 27.65,38.63 27.65,43.45 v23.95,47.15
  Bottom 1.27: U5.2 28.05,39.47 | 28.05,39.47 U5.TAB | C14.2 27.83,38.45 27.83,39.25 28.05,39.47
A0  (via drill 0.3)
  Top 0.254: v57.95,39.45 U4.36
  Bottom 0.254: v57.95,39.45 57.91,30.35 55.67,27.97 J20.6 54.81,23.16 53.9,22.25 51.93,22.25 J7.1
A1  (via drill 0.3)
  Top 0.254: v57.3,40.25 U4.37
  Bottom 0.254: v57.3,40.25 57.3,30.93 56.42,29.9 52.75,29.9 52.27,29.41 J20.5 52.3,27.93 52.3,24.45 50.1,22.25 48.95,22.25 48.1,21.4 48.1,18.05 48.69,17.46 J8.1
A2  (via drill 0.3)
  Top 0.254: U4.38 v56.6,41.05
  Bottom 0.254: J20.4 49.92,27.97 | v56.6,41.05 56.6,31.43 55.87,30.5 50.46,30.5 49.75,29.79 49.75,27.99 J20.4 | J9.1 48.38,14.92 47.2,16.1 47.2,22.15 49.7,24.65 49.7,27.94 J20.4
A3  (via drill 0.3)
  Top 0.254: v56.05,41.85 54.5,41.85 54.35,41.7 53.95,41.7 U4.39
  Bottom 0.254: J10.1 49.65,12.35 47.05,12.35 46.1,13.3 46.1,22.25 47.19,23.34 J20.3 47.19,30.09 48,30.9 48.05,30.9 48.2,31.1 55.33,31.1 55.8,31.77 55.8,41.8 v56.05,41.85
A4  (via drill 0.3)
  Top 0.254: U4.40 v55.1,42.65
  Bottom 0.254: v55.1,42.65 55.1,32.1 54.75,31.75 45.8,31.75 44.65,30.6 J20.2 44.65,22.15 45.25,21.55 45.25,10.35 45.76,9.84 J11.1
A5  (via drill 0.3)
  Top 0.254: v55.2,43.5 53.85,43.5 U4.41
  Bottom 0.254: J12.1 45.5,7.3 44.7,8.1 44.7,20.95 42.11,23.54 J20.1 42.11,28.86 45.5,32.25 54.13,32.25 54.55,32.67 54.55,42.25 54.3,42.5 54.3,43 54.8,43.5 v55.2,43.5
D0/RX  (via drill 0.3)
  Top 0.254: U2.1 33.34,74.47 33.5,74.3 33.5,63.4 34.2,62.7 34.2,47.6 33.6,47 33.6,39.5 v33.65,39.45 | v35.8,39.45 36.55,39.45 37.1,38.9 40.85,38.9 41.3,39.35 42.1,39.35 U4.20 42.15,39.4
  Bottom 0.254: v35.8,39.45 v33.65,39.45
D1/TX
  Top 0.254: U2.8 36.04,74.5 34.8,74.5 34.22,73.93 34.22,64.08 35,63.3 35,47.15 34.7,46.85 34.7,39 35.5,38.2 41.05,38.2 41.5,38.65 U4.21 42.15,38.6
D2  (via drill 0.3, 0.3 pad 0.61)
  Top 0.254: U4.19 41.45,40.25 40.7,39.5 38,39.5 v38,39.6 | v18.29,29.16 20.06,29.16 21.8,30.9 28.95,30.9 29.65,31.6 v29.65,37.15
  Bottom 0.254: v29.65,37.15 35.6,37.15 37.95,39.5 v38,39.6
  Bottom 0.305: U3.4 12.06,9.63 12.7,8.99 R6.1 13.21,8.98 13.21,7.47 13.46,7.21 17.12,7.21 18.29,8.38 v18.29,29.16
D3  (via drill 0.3 pad 0.61)
  Top 0.254: J13.1 v34.59,23.5 v34.6,23.5 | U4.18 41.45,41.05 40.6,40.2 v40.25,40.2
  Top 0.406: J13.1 34.63,20 J1.1 38.1,20
  Bottom 0.254: v34.6,23.5 34.6,34.08 36.72,36.2 39.46,36.2 40.25,36.99 v40.25,40.2
D4  (via drill 0.3)
  Top 0.254: J2.1 34.63,17.46 J13.2 | U4.25 45.6,31.5 45,30.9 41.2,30.9 39.95,29.65 39.95,26.56 38.44,25.05 33.8,25.05 32,23.25 32,17.5 v32.05,17.45
  Bottom 0.254: v32.05,17.45 34.57,17.45 J13.2
D5  (via drill 0.3, 0.3 pad 0.61)
  Top 0.254: U4.31 v50.4,33 | v1.52,26.92 18.82,26.92 21.89,30 35.9,30 36.2,30.3 v36.2,33
  Bottom 0.254: v50.4,33 36.55,33 36.15,32.95 v36.2,33
  Bottom 0.305: J3.1 2.7,12.8 1.5,14 1.5,26.9 v1.52,26.92
D6  (via drill 0.3, 0.3 pad 0.61)
  Top 0.254: 22.29,29.49 36.19,29.49 36.85,30.15 v36.85,33.65 | U4.27 v47.2,33.75 47.25,33.7 | 22.29,29.49 22.3,29.5 | 22.29,29.49 18.9,26.1 4.13,26.1 v4.12,26.11
  Bottom 0.254: v47.2,33.75 36.95,33.75 | 36.95,33.75 36.85,33.85 | v36.85,33.65 36.95,33.75
  Bottom 0.305: J4.1 v4.12,26.11
D7  (via drill 0.3)
  Top 0.254: v57.6,47.6 52.05,47.6 U4.1
  Bottom 0.254: 58,6 58,24.6 59.25,25.85 59.25,46.8 58.45,47.6 v57.6,47.6
  Bottom 0.305: J19.2 28.67,3.33 31,1 52,1 55.5,4.5 56.5,4.5 58,6
D8  (via drill 0.3)
  Top 0.254: v48,34.45 U4.28 | v58.6,34.45 v52.85,34.45
  Bottom 0.254: 57,6.5 57,24.5 58.65,26.15 v58.6,34.45 | v48,34.45 v52.85,34.45
  Bottom 0.305: 57,6.5 56,5.5 55,5.5 51.25,1.75 32.3,1.75 31.2,2.85 31.2,4.43 J19.3
D9
  Top 0.254: U4.29 48.8,32.4 46.45,30.05 46.05,29.65 46.05,7.11 41.14,2.2 24.15,2.2 22.5,3.85 22.5,11.2 22.72,11.42 D1.3
D10
  Top 0.254: U4.30 49.6,31.1 48.4,29.9 48.4,22.45 47.35,21.4 47.35,7.45 41.15,1.25 23.9,1.25 21.7,3.45 21.7,13.85 22.6,14.75 23.8,14.75 D1.1
D11  (via drill 0.3)
  Top 0.254: D1.2 25.07,13.12 25.7,13.75 25.7,17.1 25.1,17.7 23,17.7 21.9,18.8 v21.9,24.3 | U4.12 38.2,45.85 v38.15,45.9 | v29.6,45.85 29.6,38.2 28.9,37.5 28.9,32.3 28.4,31.8 22.1,31.8 v21.95,31.85
  Bottom 0.254: v38.15,45.9 29.65,45.9 v29.6,45.85 | v21.9,24.3 21.95,24.3 v21.95,31.85
D12
  Top 0.254: U4.26 46.4,31.06 45.44,30.1 41.45,30.1 40.75,29.4 40.75,26.14 38.77,24.15 33.8,24.15 32.7,23.05 32.7,15.4 33.32,14.88 J13.3
  Top 0.305: J13.3 37.98,14.88 J5.1
  Top 0.406: 38.02,14.94 J5.1
D13  (via drill 0.3)
  Top 0.254: 37.95,12.31 J6.1 38.02,8.03 39.8,6.25 v43.65,6.25 | v47.25,6.25 48.1,7.1 48.1,20.8 51,23.7 51,31.35 51.2,31.55 U4.32
  Top 0.406: J13.4 37.98,12.34 J6.1
  Bottom 0.254: v43.65,6.25 v47.25,6.25
D14/MISO  (via drill 0.3, 0.3 pad 0.61)
  Top 0.254: U4.11 v44,56.4 | v32.1,28.55 31.92,28.47 22.63,28.47 20.7,26.54 20.7,24.36 v20.68,24.33 | v32.1,30.95 32.15,48.4 v32.15,48.55
  Top 0.305: v10.82,4.84 SW2.P$1
  Top 0.406: SW2.P$4 SW2.P$1
  Bottom 0.254: v32.1,28.55 v32.1,30.95 | v44,56.4 40.16,56.4 J16.1 38.84,55.1 37.8,55.1 35.6,52.9 35.6,48.8 35.35,48.55 v32.15,48.55
  Bottom 0.305: R7.1 12.53,3.22 10.92,4.83 | 10.92,4.83 v10.82,4.84 | 10.92,4.83 10.92,5.59 11.89,6.55 17.75,6.55 20.63,9.42 20.68,22.66 v20.68,24.33
D15/SCK  (via drill 0.3)
  Top 0.254: J17.4 32.54,9.66 31.35,10.75 31.35,23.8 v32.8,25.15 | U4.9 v45.6,53.85 | v32.8,34.9 32.8,47.6 | 32.8,47.6 32.75,47.65 | v32.8,47.8 33,47.8 32.8,47.6
  Bottom 0.254: v45.6,53.85 39.9,53.85 39.17,53.12 J16.3 36.8,52.56 36.2,51.96 36.2,48.2 35.8,47.8 v32.8,47.8 | v32.8,25.15 v32.8,34.9
D16/MOSI  (via drill 0.3)
  Top 0.254: J17.2 27.46,9.31 28.05,9.9 29.2,9.9 30.2,10.9 30.2,24.1 30.6,24.5 v30.6,25.4 | U4.10 v44.8,52.45 | v30.75,47.1 v30.75,30.9
  Bottom 0.254: v44.8,52.45 41.58,52.45 | J16.4 41.73,52.53 41.58,52.45 | 41.58,52.45 40.43,51.3 37.9,51.3 36.95,50.35 36.95,47.8 36.25,47.1 v30.75,47.1 | v30.75,30.9 30.75,25.55 v30.6,25.4
D17/SS  (via drill 0.3)
  Top 0.254: U4.8 v46.4,49.3 v46.4,54.3 | v52.35,54.3 53.65,54.3 R15.1 | J17.3 30,9.75 30.75,10.5 30.75,23.95 31.4,24.6 v31.4,26.4 | v31.4,44.2 v31.4,32.15
  Bottom 0.254: v46.4,54.3 v52.35,54.3 | 46.4,49.45 v46.4,49.3 43.85,49.3 41.7,47.15 41.7,46.1 39.8,44.2 v31.4,44.2 | v31.4,26.4 v31.4,32.15
GND  (via drill 0.3, 0.3 pad 0.61, 0.6)
  Top 0.254: v48.8,49.7 U4.5 | SW1.P$2 SW1.P$3 | U2.2 31.52,73.83 v31.3,74.05 | XTAL.2 38.45,41.95 38.25,42.15 38.25,42.65 37.8,43.1 37.58,43.1 XTAL.4 | U4.15 41.5,43.45 v40.85,44.1
  Top 0.305: C5.2 7.01,21.74 v6.76,21.49
  Top 0.406: 17,3.23 17.07,3.3 17.55,3.3 SW2.P$3
  Top 1.27: J7.3 J8.3 J9.3 J10.3 J11.3 J12.3
  Top 1.676: J1.3 J2.3 J5.3 J6.3
  Bottom 0.254: 7.59,54.32 7.62,54.36 8.19,54.86 R20.1 | 50.55,51.55 C10.2 48.8,49.86 v48.8,49.7 | v31.3,74.05 31.35,74 | R4.1 29.65,16.5 v29.35,16.5 | C16.2 37.1,41.06
  Bottom 0.305: 7.99,16.82 6.25,16.82 | 6.25,16.82 6.2,16.76 | 6.2,16.76 5.84,16.41 | 6.25,16.82 5.59,16.82 | v6.76,21.49 5.84,20.57 5.84,17.27 | 5.84,17.27 5.84,16.2 | 5.84,17.27 5.89,17.22 | 5.89,17.22 6.2,16.92 6.2,16.76 | 5.89,17.22 5.64,16.97 5.59,16.97 | R6.2 15.12,9.89 15.9,10.67 15.9,12.01 U3.1
  Bottom 0.406: R4.1 R5.1 R3.1 | 33.78,3.72 J19.4 | C6.2 7.99,16.82 7.99,15.38 Q1.2 | 8.08,54.82 R20.1
  Bottom 0.508: 5.59,16.82 5.84,16.56 5.84,16.41 5.84,16.2 5.84,9.2
  Bottom 0.61: J4.3 4.98,16.2 5.59,16.82 | J3.3 4.37,7.72 5.84,9.2
  other vias: 38,30 11,63 16.5,57.8 56.4,45.2 51.4,40.8 38.95,57.4 40.8,65.75
  pour Bottom (isolate 0.305, hatched): 1,2 2,1 58,1 59,2 59,78 58,79 2,79 1,78
  pour Top (isolate 0.305, hatched): 3,79 58,79 59,78 59,3 57,1 2.12,1 1,2.12 1,77
HWB  (via drill 0.3 pad 0.61)
  Top 0.254: U4.33 56.37,36.05 58.75,38.48 58.75,49.65 v57.7,50.7
  Bottom 0.254: v57.7,50.7 57.55,50.7 R17.1
N$1  (via drill 0.3 pad 0.61)
  Top 0.305: v5.99,23.82 5.99,20.47 6.45,20.02 v8.23,20.02
  Bottom 0.305: U3.7 14.61,19.28 13.41,20.47 12.34,20.47 11.89,20.02 v8.23,20.02 8.23,21.71 R9.2 | R8.1 v5.99,23.82
N$2  (via drill 0.3 pad 0.61)
  Top 0.406: R10.2 12.61,8.5 13.31,9.2 v13.31,10.36
  Bottom 0.406: v13.31,10.36 13.31,12.01 U3.3
N$3  (via drill 0.3)
  Top 0.406: v26.5,11.35 28.6,11.35 D1.4
  Bottom 0.406: R3.2 26.93,10.92 v26.5,11.35
N$4  (via drill 0.3 pad 0.61)
  Top 0.406: D1.6 26.8,14.82 26.45,14.47 v26.46,14.03
  Bottom 0.406: v26.46,14.03 26.46,14.82 26.88,15.24 27.7,15.24 R4.2
N$5
  Bottom 0.61: U1.3 U1.2 11.29,46.09 C2.1 R1.2
  Bottom 0.813: C2.1 11.45,49.33 D3.C
N$6  (via drill 0.3 pad 0.61)
  Top 0.406: v26.36,13.11 28.66,13.11 D1.5
  Bottom 0.406: R5.2 v26.36,13.11
N$8
  Bottom 0.406: R13.1 51.1,73.6 WIFI1.EN
N$9
  Bottom 0.61: U1.4 14.41,43.86 14.95,44.4 R1.1
N$10  (via drill 0.3)
  Top 0.406: BUZZ1.P$1 10.97,11.18 | 10.97,11.18 BUZZ1.P$4 | 10.97,11.18 11.23,11.44 11.23,12.9 11.48,13.16 11.48,14.18 v11.5,14.2
  Bottom 0.406: v11.5,14.2 9.97,14.2 Q1.3
N$11  (via drill 0.3 pad 0.61)
  Top 0.305: v12.9,19.71 12.9,21.29 12.45,21.74 v11.29,21.74 R9.1
  Bottom 0.305: U3.6 13.34,19.28 v12.9,19.71 | R9.1 v11.29,21.74
  Bottom 0.406: U3.6 13.34,14.81 14.63,13.51 14.63,12.06 U3.2
N$12
  Bottom 0.813: 9.9,39.75 7.65,42 D2.1 6.45,42 5.8,42.65 C3.2 | 9.9,39.6 9.9,37.6
  Bottom 1.27: L1.1 8.25,34.35 9.8,35.9 9.8,36.8 | 9.8,36.8 9.8,37.5 | 9.8,37.5 9.9,37.6 | 9.9,39.75 9.9,39.6 | 9.9,39.05 9.9,38 10,37.9 | 10,37 9.8,36.8 | 9.8,37.5 9.8,39.5 9.9,39.6 | 9.9,39.6 9.9,39.05 | 9.9,39.05 U1.8
N$13
  Bottom 0.305: U3.5 12.06,18.67 11.84,18.9 8.24,18.9 C6.1
N$15  (via drill 0.3 pad 0.61)
  Top 0.406: R10.1 v7.72,11.58
  Bottom 0.406: v7.72,11.58 arc-1 Q1.1
N$16  (via drill 0.3)
  Top 0.406: v38.75,65.45 R2.1
  Bottom 0.406: WIFI1.GPIO15 38.7,65.5 v38.75,65.45
N$18
  Top 0.305: J14.D+ 51.97,66.3 R25.2 51.85,65.4 51.6,65.15 50.45,65.15 50.23,64.93 RN1.7
N$19
  Top 0.254: RN1.8 49.4,64.31 49.4,63.65 52.55,63.65 52.8,63.9 52.8,65.2 53.25,65.65 J14.D-
  Top 0.305: RN1.8 49.43,65.87
  Top 0.406: 49.43,65.87 R26.2
N$20
  Bottom 0.254: D6.1 26.68,65.42 26.5,65.6
  Bottom 1.422: 24.23,75 25.2,75 25.2,65.6 | 25.2,65.6 26.5,65.6 27,65.6 | Q2.2 25.2,64.29 25.2,65.6
  Bottom 1.676: J15.PWR 10.31,69.31 16,75 24.23,75 J18.1
N$21
  Bottom 0.254: Q4.3 6.45,51.66 7.11,52.32 11.52,52.32 14.45,55.25 14.45,57.07 R21.2 14.55,57 15.55,57 16.59,55.96 D5.3
N$22  (via drill 0.3)
  Top 0.406: J14.VUSB 53.7,65 53.5,64.8 53.5,60.9 v51.4,58.8
  Bottom 0.406: v51.4,58.8 F1.1
N$23
  Bottom 1.676: Q2.1 22.57,60.57 L2.1
N$25
  Bottom 0.254: U7.5 8.4,59.07 R11.1 8.8,59.1 10.15,57.75 10.15,56.75 R12.2
  Bottom 0.61: U7.5 15.47,59.07 16.7,60.3 18.34,60.3 U7.3
N$27
  Bottom 0.61: C3.1 9.63,44.25 U1.1
N$29
  Bottom 0.406: U7.1 19.42,62.88 20.83,61.47 20.83,58.93 19,57.1 D5.1
  Bottom 0.61: Q3.3 21.19,52.46 20.6,53.05 20.6,56.45 20.3,56.75 19.15,56.75 D5.1
N$30  (via drill 0.3)
  Top 0.254: U4.17 41.35,41.85 40.4,40.9 37.3,40.9 37.15,41.05 37.15,41.93 XTAL.1 v35.55,41.95
  Bottom 0.254: C15.1 35.76,42.91 35.55,42.7 v35.55,41.95
N$31  (via drill 0.3)
  Top 0.254: U4.16 41.2,42.65 v40.75,43.1 40.35,43.5 39.38,43.5 XTAL.3
  Bottom 0.254: v40.75,43.1 40.75,41.9 40.1,41.25 38.99,41.25 C16.1
N$34  (via drill 0.3)
  Top 0.254: v48,49.15 U4.6
  Bottom 0.254: C10.1 47.75,49.4 v48,49.15
N$35  (via drill 0.3)
  Top 0.254: U4.24 v44.8,37.55
  Bottom 0.254: C12.1 47.99,37.55 v44.8,37.55 44.8,38.52 L3.2
N$38
  Top 0.254: D8.A R15.2
N$40
  Bottom 1.016: 21.61,66.36 21.75,66.5
  Bottom 1.422: 21.61,66.36 Q2.3
  Bottom 1.676: SW3.COM 22.85,67.6 21.75,66.5
N$42
  Bottom 1.422: D6.3 29.2,70.68 SW3.1
N$44
  Bottom 0.254: 22.19,44.42 D4.C
  Bottom 1.27: U5.3 C13.2 21.71,45.05 D4.C
N$46  (via drill 0.3)
  Top 0.254: v44,59.7 42.95,59.7 D9.C
  Bottom 0.254: R18.2 43.99,59.69 v44,59.7
N$47  (via drill 0.3 pad 0.61)
  Top 0.254: v59.1,54.3 59.1,52.7 59.08,52.68 58.8,52.4 57.95,52.4 D7.A
  Bottom 0.254: v59.1,54.3 R16.2
N$48  (via drill 0.3, 0.3 pad 0.61)
  Top 0.406: v14.73,61.98 17.32,61.98 18.7,60.6 v18.7,53.05
  Bottom 0.406: U7.7 14.36,61.61 v14.73,61.98 | v18.7,53.05 18.7,54.71 D5.2
N$49  (via drill 0.3)
  Top 0.254: v7.2,62.55 5.45,62.55 5.15,62.25 5.15,60.2 v3.7,58.75
  Bottom 0.254: U7.2 18.24,61.47 15.75,61.47 14.62,60.34 U7.6 13.07,60.45 11.15,60.45 9.05,62.55 v7.2,62.55 | 5.01,58.35 5.31,58.39 5.58,58.42 | R20.2 8.19,56.74 8.14,56.8 | v3.7,58.75 5.17,58.75 R19.1
  Bottom 0.61: 5.01,58.35 5.01,57.59 5.8,56.8 8.14,56.8 | R19.1 5.19,58.51 5.31,58.39
RD_N
  Top 0.254: RN1.1 49.4,62.96 49.4,62.3 50.02,61.68 50.02,50.22 49.9,50.1 49.9,49.55 50.4,49.05 U4.3
RD_P  (via drill 0.3)
  Top 0.254: U4.4 v49.6,48.85 | v50.6,49.8 50.6,61.9 50.3,62.2 50.3,62.92 RN1.2 50.26,62.96
  Bottom 0.254: v49.6,48.85 49.6,48.95 v50.6,49.8
RESET  (via drill 0.3, 0.3 pad 0.61)
  Top 0.254: U4.13 39.24,45.05 v39.17,45.04 | SW1.P$4 v43.1,75.3 SW1.P$1 | v43.1,69.9 43.08,69.88 R22.1 38.35,64.45 v38.3,64.4 | J16.5 37.29,50.01 36.9,50.4 v36.9,60.9
  Bottom 0.254: v39.17,45.04 39.17,50.05 J16.5 | v43.1,69.9 v43.1,75.3 | v38.3,64.4 38.3,62.3 v36.9,60.9
RXD_3.3  (via drill 0.3 pad 0.61)
  Top 0.254: U2.5 37.02,72.53 v37.15,72.4
  Bottom 0.254: v37.15,72.4 37.15,75.3 36.95,75.5 WIFI1.RXD
TX_LED  (via drill 0.3)
  Top 0.254: v53.15,35.4 56.84,35.4 59.3,37.86 59.3,50.85 v59,51.15 59.1,51.05 | v42.2,36.05 U4.22
  Bottom 0.254: 57.95,52.4 R16.1 59,51.25 v59,51.15 | v53.15,35.4 52.5,36.05 v42.2,36.05
TXD_3.3  (via drill 0.3 pad 0.61)
  Top 0.254: v29.6,77.5 29.6,72.95 30,72.55 32.41,72.55 U2.4
  Bottom 0.254: WIFI1.TXD v29.6,77.5
U4  (via drill 0.3)
  Top 0.406: v51.6,44.2 53.75,44.2 U4.42
  Bottom 0.406: C11.1 50.59,45.21 v51.6,44.2
VCC  (via drill 0.6)
  Top 1.016: v7.2,61 7.2,53.3 10.7,49.8 v17.6,49.8
  Bottom 1.016: R11.2 v7.2,61
  Bottom 1.676: L2.2 25.05,60.25 26.5,58.8 26.5,51 25.1,49.6 D4.A 18.21,49.59 18,49.8 v17.6,49.8 | 17.4,49.8 v17.6,49.8 | v17.6,49.8 D3.A
VUSB  (via drill 0.3, 0.3 pad 0.61)
  Top 0.406: U4.7 47.2,53.1 47.7,53.6 v47.7,55.6 | v55.8,56.4 56,56.6 56,57.53 R27.2
  Top 0.61: v33.4,62.4 28.53,62.4 22.02,55.89 | 22.02,55.89 v21.93,55.8 | 22.02,55.89 22.02,59.58 18.6,63 | v27,68.6 20.5,68.6 18.6,66.7 18.6,63 | 18.6,63 v15.5,63 | v2.03,52.32 5.58,52.32 7.4,50.5 v7.4,49.7
  Bottom 0.254: 5.31,60.76 R19.2 | 26.85,67.47 D6.2 | F1.2 46.15,59.5 46.35,59.3 46.2,59.3
  Bottom 0.305: 5.76,49.78 Q4.2
  Bottom 0.406: v21.93,55.8 21.84,55.88 | F1.2 46.3,59.28 46.3,58.6 46,58.3 46,56.3 46.7,55.6 v47.7,55.6 55,55.6 v55.8,56.4 | v55.8,56.4 56,56.6 C17.1 | v55.8,56.4 58.2,56.4 58.4,56.6 58.4,57.77 C18.1
  Bottom 0.61: 46.2,59.3 46.2,60 44.8,61.4 39.5,61.4 38,59.9 36.3,59.9 34.9,61.3 34.9,61.8 34.3,62.4 v33.4,62.4 | Q3.2 v21.93,55.8 | D6.2 v27,68.6 | U7.8 13.3,63 v15.5,63 15.5,63.8 14.8,64.5 C9.1 14.76,65.1 7.4,65.1 5.2,62.9 R19.2 5.17,60.6 3.3,60.6 2.03,59.33 v2.03,52.32 | v7.4,49.7 5.74,49.7 Q4.2

### Text on the board
tPlace: ON | RESET | ON | ICSP
bPlace: bilbaodynamics.com | BD Robotics 2016 uBot | Pinchy | Designed and assembled in Bizkaia | IO6 | + | - | IO5 | + | -
tNames: A5 | A4 | A3 | A2 | A1 | A0 | IO1 | A0 | - | 3V3 | 5V | IO2 | A1 | IO3 | A2 | IO4 | A3 | IO | + | - | A4 | A5 | A | + | - | IO7 | IO8 | + | -
Document: Poner Polaridad condensadores de Tantalo / Añadir conector definitivo matriz